# Altium schematic sheet Sheet4_Carregador_Bateria.SchDoc
size A4; SheetNumber: 4; SheetTotal: 6
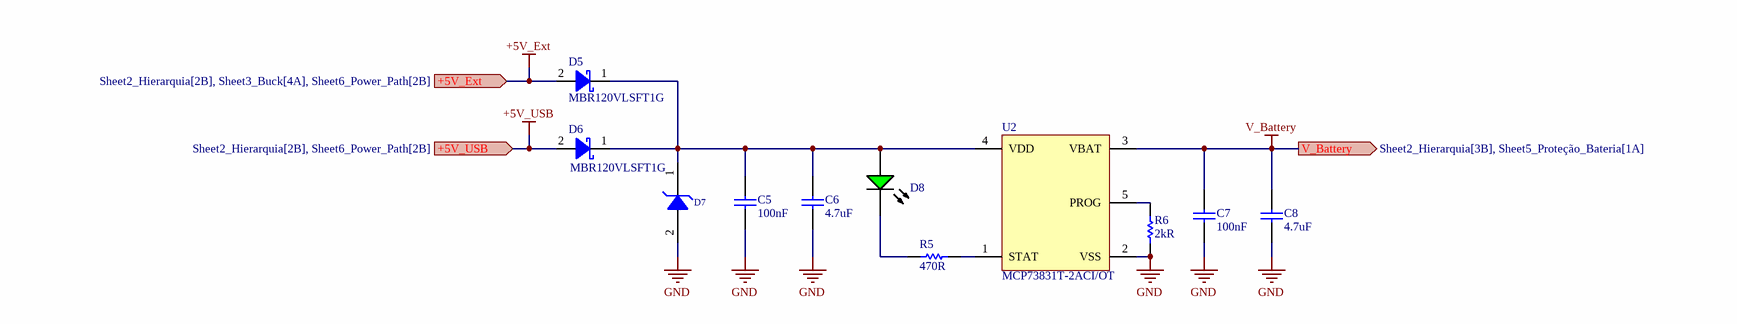
[diagram p0: Sheet4_Carregador_Bateria.SchDoc]

## Parts
?  (no value)  (graphical)
C5  value 100nF  [C-0805]  (hidden comment: CL21B104KACNNNC)
C6  value 4.7uF  [C-0805]  (hidden comment: C2012X5R1E475K125AB)
C7  value 100nF  [C-0805]  (hidden comment: CL21B104KACNNNC)
C8  value 4.7uF  [C-0805]  (hidden comment: C2012X5R1E475K125AB)
D5  MBR120VLSFT1G  [SOD-123F]
D6  MBR120VLSFT1G  [SOD-123F]
D7  SMAJ5.0A-13-F  [DO-214AC]  (value not drawn)
D8  LTST-C170GKT  [0805-LED-G]  (value not drawn)
R5  value 470R  [R-0805]  (hidden comment: CRGCQ0805J470R)
R6  value 2kR  [R-0805]  (hidden comment: ERJ-6ENF2001V)
U2  MCP73831T-2ACI/OT  [TSOT-23-5_A]

## Ports
+5V_Ext (in, see Sheet2_Hierarquia[2B], Sheet3_Buck[4A], Sheet6_Power_Path[2B]), +5V_USB (in, see Sheet2_Hierarquia[2B], Sheet6_Power_Path[2B]), V_Battery (out, see Sheet2_Hierarquia[3B], Sheet5_Proteção_Bateria[1A])

## Nets
+5V_Ext: D5.2(A) ; port +5V_Ext
+5V_USB: D6.2(A) ; port +5V_USB
GND: C5.2 C6.2 C7.2 C8.2 D7.2(A) R6.1 U2.2(VSS)
V_Battery: C7.1 C8.1 U2.3(VBAT) ; port V_Battery
NetC5_1: C5.1 C6.1 D5.1(K) D6.1(K) D7.1(K) D8.2(A) U2.4(VDD)
NetD8_1: D8.1(K) R5.1
NetR5_2: R5.2 U2.1(STAT)
NetR6_2: R6.2 U2.5(PROG)

## Notes on the sheet
- Título:
- Endereço
- Rua Aprígio Veloso, 1500 - Bodocongó
  CEP: 58.429-140
  Campina Grande - Paraíba
  Brasil
- Projeto:
- Conta:
- Projetista:
- Arquivo:
- Data:
- Revisor:
- Rev.:
- Pág.:
- de

## Library data of the parts
? = Title Block
C5 C7 = CL21B104KACNNNC: CAP CER 0.1UF 25V X7R 0805; Manufacturer: Samsung; Material: Ceramic; Tolerance: 10%; Supplier: Digikey; Supplier Part Number: 1276-1099-6-ND; Manufacturer Part Number: CL21B104KACNNNC; RoHS: Yes; Category: Ceramic Capacitors; Stock: 257719; Pricing: 1=0,1, 10=0,031, 50=0,0208, 100=0,0178, 500=0,01262, 1000=0,01102 (USD); Mounting Technology: Surface Mount; Case/Package: 0805; Case Code (Metric): 2012; Case Code (Imperial): 0805; Min Operating Temperature: -55°C; Max Operating Temperature: 125°C; Package Quantity: 1; Packaging: Tape and Reel; Voltage Rating: 25V; Dielectric: X7R; Voltage: 25V; Series: CL; Construction: Flat; Length: 2mm; Width: 0.049inch; Height: 0.85mm; Thickness: 0.037inch; Depth: 1.25mm; Radiation Hardening: No; RoHS Compliant: Yes; ComponentLink1URL: https://datasheet.ciiva.com/25801/cl21b104kacnnnc-25801824.pdf?src-supplier=Digikey; ComponentLink1Description: https://datasheet.ciiva.com/25801/cl21b104kacnnnc-25801824.pdf?src-supplier=Digikey; ComponentLink2URL: https://datasheet.ciiva.com/15216/getdatasheetpartid-355204-15216236.pdf?src-supplier=Verical; ComponentLink2Description: https://datasheet.ciiva.com/15216/getdatasheetpartid-355204-15216236.pdf?src-supplier=Verical; Supplier 1: Digikey; Supplier Part Number 1: 1276-1099-1-ND; Supplier 2: Mouser; Supplier Part Number 2: 187-CL21B104KACNNNC; Voltage Rating (DC): 25V
C6 C8 = C2012X5R1E475K125AB: CAP CER 4.7UF 25V X5R 0805; Manufacturer: TDK; Dielectric Material: Ceramic; Tolerance: 10%; Supplier: Digikey; Supplier Part Number: 445-4116-1-ND; Manufacturer Part Number: C2012X5R1E475K125AB; RoHS: Yes; Category: Ceramic Capacitors; Stock: 2075676; Pricing: 1=0,27, 10=0,158, 50=0,1126, 100=0,0984, 500=0,07452, 1000=0,06706 (USD); Mounting Technology: Surface Mount; Case/Package: 0805; Pins: 2; Case Code (Imperial): 0805; Case Code (Metric): 2012; Weight: 0.000194oz; Material: Ceramic; Min Operating Temperature: -55°C; Max Operating Temperature: 85°C; Voltage Rating: 25V; Voltage Rating (DC): 25V; Packaging: Tape and Reel; Package Quantity: 2000; Dielectric: X5R; Termination: SMD/SMT; Voltage: 25V; Series: C; Construction: Flat; Length: 2mm; Width: 1.25mm; Height: 1.25mm; Depth: 1.25mm; Reach SVHC Compliant: No; Lead Free: Lead Free; RoHS Compliant: Yes; ComponentLink1URL: https://datasheet.ciiva.com/24216/tdkmlcccaprange-24216480.pdf?src-supplier=Mouser; ComponentLink1Description: https://datasheet.ciiva.com/24216/tdkmlcccaprange-24216480.pdf?src-supplier=Mouser; ComponentLink2URL: https://datasheet.ciiva.com/11788/0900766b80c1bb00-11788107.pdf?src-supplier=Rs; ComponentLink2Description: https://datasheet.ciiva.com/11788/0900766b80c1bb00-11788107.pdf?src-supplier=Rs; ComponentLink3URL: https://datasheet.ciiva.com/6251/tdkmlcccaprange-6251817.pdf?src-supplier=Digikey; ComponentLink3Description: https://datasheet.ciiva.com/6251/tdkmlcccaprange-6251817.pdf?src-supplier=Digikey; ComponentLink4URL: https://datasheet.ciiva.com/6251/tdkmlcccaprange-6251820.pdf?src-supplier=Digikey; ComponentLink4Description: https://datasheet.ciiva.com/6251/tdkmlcccaprange-6251820.pdf?src-supplier=Digikey; ComponentLink5URL: https://datasheet.ciiva.com/6251/tdkmlcccaprange-6251823.pdf?src-supplier=Digikey; ComponentLink5Description: https://datasheet.ciiva.com/6251/tdkmlcccaprange-6251823.pdf?src-supplier=Digikey; ComponentLink6URL: https://datasheet.ciiva.com/28602/1744655-28602173.pdf?src-supplier=Element14; ComponentLink6Description: https://datasheet.ciiva.com/28602/1744655-28602173.pdf?src-supplier=Element14; ComponentLink7URL: https://datasheet.ciiva.com/36857/1796654-36857301.pdf?src-supplier=Element14; ComponentLink7Description: https://datasheet.ciiva.com/36857/1796654-36857301.pdf?src-supplier=Element14; ComponentLink8URL: https://datasheet.ciiva.com/16449/e412-c-16449599.pdf?src-supplier=Future+Electronics; ComponentLink8Description: https://datasheet.ciiva.com/16449/e412-c-16449599.pdf?src-supplier=Future+Electronics; Supplier 1: Mouser; Supplier Part Number 1: 810-C2012X5R1E475K; Supplier 2: Digikey; Supplier Part Number 2: 445-4116-1-ND
D5 D6 = MBR120VLSFT1G: DIODE SCHOTTKY 20V 1A SOD123FL; Manufacturer: ON Semiconductor; Max Surge Current: 45A; Forward Voltage: 340mV; Max Reverse Current: 600uA; Element Configuration: Single; Polarity: Standard; Supplier: Digikey; Supplier Part Number: MBR120VLSFT1GOSCT-ND; Manufacturer Part Number: MBR120VLSFT1G; RoHS: Yes; Category: Schottky Diodes; Stock: 20847; Pricing: 1=0,56, 10=0,348, 100=0,2217, 500=0,16708, 1000=0,14944 (USD); Pins: 2; Min Operating Temperature: -65°C; Max Operating Temperature: 125°C; Package Quantity: 3000; Forward Current: 1A; Packaging: Tape and Reel; Max Reverse Leakage Current: 600uA; Average Rectified Current: 1A; Max Repetitive Reverse Voltage (Vrrm): 20V; Max Forward Surge Current (Ifsm): 45A; Peak Non-Repetitive Surge Current: 45A; Voltage Rating (DC): 20V; Current Rating: 1A; Output Current: 1A; Max Reverse Voltage (DC): 20V; Series: -; Length: 0.114inch; Width: 0.071inch; Height: 0.035inch; Radiation Hardening: No; Reach SVHC Compliant: No; Lead Free: Lead Free; Halogen Free: Halogen Free; RoHS Compliant: Yes; ComponentLink1URL: https://datasheet.ciiva.com/7962/85900-7962720.pdf?src-supplier=Element14; ComponentLink1Description: https://datasheet.ciiva.com/7962/85900-7962720.pdf?src-supplier=Element14; ComponentLink2URL: https://datasheet.ciiva.com/915/mbr120vlsft1-d-915659.pdf?src-supplier=Digikey; ComponentLink2Description: https://datasheet.ciiva.com/915/mbr120vlsft1-d-915659.pdf?src-supplier=Digikey; ComponentLink3URL: https://datasheet.ciiva.com/915/mbr120vlsft1-d-915660.pdf?src-supplier=Digikey; ComponentLink3Description: https://datasheet.ciiva.com/915/mbr120vlsft1-d-915660.pdf?src-supplier=Digikey; ComponentLink4URL: https://datasheet.ciiva.com/18435/70100467-18435526.pdf?src-supplier=Allied+Electronics; ComponentLink4Description: https://datasheet.ciiva.com/18435/70100467-18435526.pdf?src-supplier=Allied+Electronics; ComponentLink5URL: https://datasheet.ciiva.com/16392/mbr120vlsft1-d-16392906.pdf?src-supplier=Future+Electronics; ComponentLink5Description: https://datasheet.ciiva.com/16392/mbr120vlsft1-d-16392906.pdf?src-supplier=Future+Electronics; Supplier 1: Digikey; Supplier Part Number 1: MBR120VLSFT1GOSCT-ND; Supplier 2: Mouser; Supplier Part Number 2: 863-MBR120VLSFT1G
D7 = SMAJ5.0A-13-F: TVS DIODE 5VWM 9.2VC SMA; Manufacturer: Diodes; Working Voltage: 5V; Clamping Voltage: 9.2V; Peak Pulse Power: 400W; Breakdown Voltage: 6.4V; Peak Pulse Current: 43.5A; Number of Elements: 1; Max Surge Current: 40A; Polarity: Unidirectional; Test Current: 10mA; Leakage Current: 800uA; Power Line Protection: No; Diode Type: ZENER; Max Breakdown Voltage: 7.25V; Element Configuration: Single; Capacitance: 2nF; Forward Voltage: 3.5V; Manufacturer Part Number: SMAJ5.0A-13-F; RoHS: Yes; Category: TVS Diodes; Stock 1: 435542; Pricing 1: 1=0,42000, 10=0,31700, 100=0,19770, 500=0,13528, 1000=0,10406, 2000=0,09366 (USD); Mount: Surface Mount; Case/Package: SMA; Number of Pins: 2; Contact Plating: Tin,Matte; Min Operating Temperature: -55°C; Max Operating Temperature: 150°C; Package Quantity: 5000; Termination: SMD/SMT; Series: -; Packaging: Tape and Reel; Reverse Standoff Voltage: 5V; Max Power Dissipation: 400W; Reverse Breakdown Voltage: 6.4V; Voltage Rating (DC): 5V; Min Breakdown Voltage: 6.4V; Resistor Type: Zener; Number of Unidirectional Channels: 1; Direction: Unidirectional; Max Reverse Leakage Current: 800uA; Power Dissipation: 400W; Clamping Voltage-Max: 9.2V; Max Output Current: 43.5A; ESD Protection: No; Length: 4.6mm; Width: 2.92mm; Height: 2.1mm; Radiation Hardening: No; RoHS Compliant: Yes; Lead Free: Lead Free; REACH SVHC: No SVHC; ComponentLink1URL: https://datasheet.ciiva.com/27052/1542127-27052431.pdf?src-supplier=Jameco; ComponentLink1Description: https://datasheet.ciiva.com/27052/1542127-27052431.pdf?src-supplier=Jameco; ComponentLink2URL: https://datasheet.ciiva.com/22696/1670961-22696859.pdf?src-supplier=Element14; ComponentLink2Description: https://datasheet.ciiva.com/22696/1670961-22696859.pdf?src-supplier=Element14; ComponentLink3URL: https://datasheet.ciiva.com/26933/getdatasheetpartid-35116-26933158.pdf?src-supplier=Verical; ComponentLink3Description: https://datasheet.ciiva.com/26933/getdatasheetpartid-35116-26933158.pdf?src-supplier=Verical; Supplier 1: Digi-Key; Supplier 2: Mouser; Supplier 3: Arrow Electronics; Supplier 4: Digi-Key; Supplier 5: Mouser; Supplier 6: Digi-Key; Supplier 7: Mouser; Supplier Part Number 7: 863-SZ1SMA5.0AT3G; Supplier Part Number 6: F11528CT-ND; Supplier Part Number 5: 625-SMAJ5.0A-E3; Supplier Part Number 4: SMAJ5.0A-E3/61GICT-ND; Supplier Part Number 3: SMAJ5.0A-13-F; Supplier Part Number 2: 621-SMAJ5.0A-13-F; Supplier Part Number 1: SMAJ5.0A-FDICT-ND; JLCPCB Part: C87074
D8 = LTST-C170GKT: LED GREEN CLEAR SMD; Manufacturer: Vishay Lite-On; Lens Color: Colorless; Luminous Intensity: 6mcd; Forward Voltage: 2.1V; Test Current: 10mA; Wavelength: 565nm; Viewing Angle: 130°; Dominant Wavelength: 569nm; Lens Style: Diffused,Colorless,Rectangular; Forward Current: 30mA; Number of LEDs: 1; Power Dissipation: 100mW; Reverse Voltage: 5V; Supplier 1: Digi-Key; Manufacturer Part Number: LTST-C170GKT; RoHS: Yes; Category: LEDs; Stock 1: 753504; Pricing 1: 1=0,30000, 10=0,16000, 100=0,07440, 500=0,06870, 1000=0,05382 (USD); Mount: Surface Mount; Case/Package: 0805; Number of Pins: 2; Color: Green; Case Code (Metric): 2012; Case Code (Imperial): 0805; Min Operating Temperature: -55°C; Max Operating Temperature: 85°C; Package Quantity: 1; Packaging: Tape and Reel; Series: CHIPLED 0805; Lens Transparency: Clear; Illumination Color: Green; Number of Elements: 1; Power Rating: 100mW; Voltage: 5V; Length: 2mm; Width: 1.25mm; Height: 1.1mm; Depth: 1.25mm; Radiation Hardening: No; RoHS Compliant: Yes; Lead Free: Lead Free; ComponentLink1URL: https://datasheet.ciiva.com/2110/ltst-c170gkt-2110128.pdf?src-supplier=Digi-Key; ComponentLink1Description: https://datasheet.ciiva.com/2110/ltst-c170gkt-2110128.pdf?src-supplier=Digi-Key; ComponentLink2URL: https://datasheet.ciiva.com/11773/0900766b80dc0278-11773630.pdf?src-supplier=RSComponents; ComponentLink2Description: https://datasheet.ciiva.com/11773/0900766b80dc0278-11773630.pdf?src-supplier=RSComponents; ComponentLink3URL: https://datasheet.ciiva.com/12400/lite-on-ltst-c170gkt-187191-12400783.pdf?src-supplier=Mouser; ComponentLink3Description: https://datasheet.ciiva.com/12400/lite-on-ltst-c170gkt-187191-12400783.pdf?src-supplier=Mouser; ComponentLink4URL: https://datasheet.ciiva.com/15117/getdatasheetpartid-142079-15117738.pdf?src-supplier=Verical; ComponentLink4Description: https://datasheet.ciiva.com/15117/getdatasheetpartid-142079-15117738.pdf?src-supplier=Verical; ComponentLink5URL: https://datasheet.ciiva.com/25772/ltst-c170gkt-25772881.pdf?src-supplier=Allied+Electronics; ComponentLink5Description: https://datasheet.ciiva.com/25772/ltst-c170gkt-25772881.pdf?src-supplier=Allied+Electronics; ComponentLink6URL: https://datasheet.ciiva.com/16387/ltst-c170gkt-16387357.pdf?src-supplier=Future+Electronics; ComponentLink6Description: https://datasheet.ciiva.com/16387/ltst-c170gkt-16387357.pdf?src-supplier=Future+Electronics; Supplier 2: Mouser; Supplier Part Number 2: 859-LTST-C170GKT; Supplier Part Number 1: 160-1179-1-ND; JLCPCB Part: C125090
R5 = CRGCQ0805J470R: RES 470 OHM 5% 1/8W 0805; Manufacturer: TE Connectivity; Max Power Dissipation: 125mW; Temperature Coefficient: 100ppm/°C; Operating Supply Voltage: 150V; Supplier: Digikey; Supplier Part Number: A130132CT-ND; Manufacturer Part Number: CRGCQ0805J470R; RoHS: Yes; Category: Chip SMD Resistors; Stock: 837845; Pricing: 1=0,1, 10=0,026, 50=0,0162, 100=0,0137, 500=0,00942, 1000=0,00813 (USD); Case/Package: 0805; Case Code (Imperial): 0805; Case Code (Metric): 2012; Min Operating Temperature: -55°C; Max Operating Temperature: 155°C; Features: Moisture Resistant,Automotive AEC-Q200; Series: CRGCQ; Packaging: Cut Tape; Tolerance: 5%; Number of Terminations: 2; Power Rating: 125mW; Voltage Rating: 150V; Voltage Rating (DC): 150V; Height: 650um; Ratings: AEC-Q200; RoHS Compliant: Yes; ComponentLink1URL: http://datasheet.octopart.com/CRGCQ0805J470R-TE-Connectivity-datasheet-114679081.pdf?src-supplier=Digikey; ComponentLink1Description: http://datasheet.octopart.com/CRGCQ0805J470R-TE-Connectivity-datasheet-114679081.pdf?src-supplier=Digikey; ComponentLink2URL: http://datasheet.octopart.com/CRGCQ0805J470R-TE-Connectivity-datasheet-114679081.pdf?src-supplier=Farnell; ComponentLink2Description: http://datasheet.octopart.com/CRGCQ0805J470R-TE-Connectivity-datasheet-114679081.pdf?src-supplier=Farnell; ComponentLink3URL: http://datasheet.octopart.com/CRGCQ0805J470R-TE-Connectivity-datasheet-114679081.pdf?src-supplier=Avnet; ComponentLink3Description: http://datasheet.octopart.com/CRGCQ0805J470R-TE-Connectivity-datasheet-114679081.pdf?src-supplier=Avnet; ComponentLink4URL: http://datasheet.octopart.com/CRGCQ0805J470R-TE-Connectivity-datasheet-114679081.pdf?src-supplier=Mouser; ComponentLink4Description: http://datasheet.octopart.com/CRGCQ0805J470R-TE-Connectivity-datasheet-114679081.pdf?src-supplier=Mouser; ComponentLink5URL: http://datasheet.octopart.com/CRGCQ0805J470R-TE-Connectivity-datasheet-114679081.pdf?src-supplier=Newark; ComponentLink5Description: http://datasheet.octopart.com/CRGCQ0805J470R-TE-Connectivity-datasheet-114679081.pdf?src-supplier=Newark; ComponentLink6URL: http://datasheet.octopart.com/CRGCQ0805J470R-TE-Connectivity-datasheet-114679081.pdf?src-supplier=Onlinecomponents.com; ComponentLink6Description: http://datasheet.octopart.com/CRGCQ0805J470R-TE-Connectivity-datasheet-114679081.pdf?src-supplier=Onlinecomponents.com; ComponentLink7URL: https://datasheet.octopart.com/CRGCQ0805J470R-TE-Connectivity-datasheet-114679081.pdf?src-supplier=Master+Electronics; ComponentLink7Description: https://datasheet.octopart.com/CRGCQ0805J470R-TE-Connectivity-datasheet-114679081.pdf?src-supplier=Master+Electronics; ComponentLink8URL: http://datasheet.octopart.com/CRGCQ0805J470R-TE-Connectivity-datasheet-114679081.pdf?src-supplier=Heilind+Electronics; ComponentLink8Description: http://datasheet.octopart.com/CRGCQ0805J470R-TE-Connectivity-datasheet-114679081.pdf?src-supplier=Heilind+Electronics; ComponentLink9URL: http://datasheet.octopart.com/CRGCQ0805J470R-TE-Connectivity-datasheet-114679081.pdf?src-supplier=Sager+Electronics; ComponentLink9Description: http://datasheet.octopart.com/CRGCQ0805J470R-TE-Connectivity-datasheet-114679081.pdf?src-supplier=Sager+Electronics; ComponentLink10URL: http://datasheet.octopart.com/CRGCQ0805J470R-TE-Connectivity-datasheet-114679081.pdf?src-supplier=Interstate+Connecting+Components; ComponentLink10Description: http://datasheet.octopart.com/CRGCQ0805J470R-TE-Connectivity-datasheet-114679081.pdf?src-supplier=Interstate+Connecting+Components; ComponentLink11URL: http://datasheet.octopart.com/CRGCQ0805J470R-TE-Connectivity-datasheet-114679081.pdf?src-supplier=Electro+Sonic; ComponentLink11Description: http://datasheet.octopart.com/CRGCQ0805J470R-TE-Connectivity-datasheet-114679081.pdf?src-supplier=Electro+Sonic; Supplier 1: Mouser; Supplier Part Number 1: 279-CRGCQ0805J470R; Supplier 2: Digikey; Supplier Part Number 2: A130132CT-ND
R6 = ERJ-6ENF2001V: RES SMD 2K OHM 1% 1/8W 0805; Manufacturer: Panasonic; Power Rating: 125mW; Voltage Rating: 150V; Temperature Coefficient: 100ppm/°C; Supplier: Digikey; Supplier Part Number: P2.00KCCT-ND; Manufacturer Part Number: ERJ-6ENF2001V; RoHS: Yes; Category: Chip SMD Resistors; Stock: 369929; Pricing: 1=0,11, 10=0,053, 50=0,0344, 100=0,0292, 500=0,02058, 1000=0,01792 (USD); Mounting Technology: Surface Mount; Case/Package: 0805; Case Code (Metric): 2012; Case Code (Imperial): 0805; Contact Plating: Tin; Weight: 0.000194oz; Min Operating Temperature: -55°C; Max Operating Temperature: 155°C; Packaging: Tape and Reel; Tolerance: 1%; Package Quantity: 1; Resistor Type: Thick Film; Number of Terminations: 2; Termination: SMD/SMT; Max Power Dissipation: 125mW; Voltage Rating (DC): 150V; Features: Automotive AEC-Q200; Series: ERJ; Resistance Tolerance: 1%; Construction: Rectangular; Technology: THICK FILM; Length: 2mm; Width: 1.2mm; Height: 0.6mm; Depth: 1.25mm; Radiation Hardening: No; Reach SVHC Compliant: No; Military Standard: Not; Lead Free: Lead Free; RoHS Compliant: Yes; Supplier 1: Mouser; Supplier Part Number 1: 667-ERJ-6ENF2001V; Supplier 2: Digikey; Supplier Part Number 2: P2.00KCCT-ND; Supplier 3: Digikey; Supplier Part Number 3: P2.00KCCT-ND
U2 = MCP73831T-2ACI/OT: IC BATT CNTL LI-ION 1CEL SOT23-5; Manufacturer: Microchip; Number of Cells: 1; Max Supply Voltage: 6V; Output Voltage: 4.2V; Min Supply Voltage: 3.75V; Output Current: 500mA; Max Output Voltage: 4.5V; Max Power Dissipation: 1.54W; Drain to Source Resistance: 350mR; Min Output Voltage: 4.168V; Voltage Rating: 4.534V; Fault Protection: Over Voltage; Supplier: Digikey; Supplier Part Number: MCP73831T-2ACI/OTCT-ND; Manufacturer Part Number: MCP73831T-2ACI/OT; RoHS: Yes; Category: Battery Management; Stock: 95605; Pricing: 1=0,76, 25=0,63, 100=0,6125 (USD); Mounting Technology: Surface Mount; Case/Package: SOT-23; Pins: 5; Weight: 0.00709oz; Min Operating Temperature: -40°C; Max Operating Temperature: 85°C; Number of Outputs: 1; Packaging: Tape and Reel; Number of Channels: 1; Termination: SMD/SMT; Max Charge Current: 500mA; Series: -; Battery Pack Voltage: 4.2V; Length: 3.1mm; Width: 1.8mm; Height: 1.3mm; Radiation Hardening: No; RoHS Compliant: Yes; Reach SVHC Compliant: No; Lead Free: Lead Free; ComponentLink1URL: https://datasheet.ciiva.com/22828/0900766b80d2b53a-22828876.pdf?src-supplier=Rs; ComponentLink1Description: https://datasheet.ciiva.com/22828/0900766b80d2b53a-22828876.pdf?src-supplier=Rs; ComponentLink2URL: https://datasheet.ciiva.com/26344/651521-da-01-en-contr-mcp73831t-2aci-ot-sot-23-5-mcp-26344458.pdf?src-supplier=Conrad; ComponentLink2Description: https://datasheet.ciiva.com/26344/651521-da-01-en-contr-mcp73831t-2aci-ot-sot-23-5-mcp-26344458.pdf?src-supplier=Conrad; ComponentLink3URL: https://datasheet.ciiva.com/1931/21984e-1931953.pdf?src-supplier=Digikey; ComponentLink3Description: https://datasheet.ciiva.com/1931/21984e-1931953.pdf?src-supplier=Digikey; ComponentLink4URL: https://datasheet.ciiva.com/1931/21984e-1931954.pdf?src-supplier=Digikey; ComponentLink4Description: https://datasheet.ciiva.com/1931/21984e-1931954.pdf?src-supplier=Digikey; ComponentLink5URL: https://datasheet.ciiva.com/1931/21984e-1931955.pdf?src-supplier=Digikey; ComponentLink5Description: https://datasheet.ciiva.com/1931/21984e-1931955.pdf?src-supplier=Digikey; ComponentLink6URL: https://datasheet.ciiva.com/3213/21984e-3213404.pdf?src-supplier=Avnet; ComponentLink6Description: https://datasheet.ciiva.com/3213/21984e-3213404.pdf?src-supplier=Avnet; ComponentLink7URL: https://datasheet.ciiva.com/28626/630369-28626439.pdf?src-supplier=Element14; ComponentLink7Description: https://datasheet.ciiva.com/28626/630369-28626439.pdf?src-supplier=Element14; ComponentLink8URL: https://datasheet.ciiva.com/46385/630369-46385324.pdf?src-supplier=Element14; ComponentLink8Description: https://datasheet.ciiva.com/46385/630369-46385324.pdf?src-supplier=Element14; ComponentLink9URL: https://datasheet.ciiva.com/1137/630369-1137803.pdf?src-supplier=Element14; ComponentLink9Description: https://datasheet.ciiva.com/1137/630369-1137803.pdf?src-supplier=Element14; ComponentLink10URL: https://datasheet.ciiva.com/1144/630369-1144461.pdf?src-supplier=Newark; ComponentLink10Description: https://datasheet.ciiva.com/1144/630369-1144461.pdf?src-supplier=Newark; ComponentLink11URL: https://datasheet.ciiva.com/16286/filehandler-aspxddocname-en025112-16286957.pdf?src-supplier=Future+Electronics; ComponentLink11Description: https://datasheet.ciiva.com/16286/filehandler-aspxddocname-en025112-16286957.pdf?src-supplier=Future+Electronics; Supplier 1: Digikey; Supplier Part Number 1: MCP73831T-2ACI/OTCT-ND; Supplier 2: Mouser; Supplier Part Number 2: 579-MCP73831T-2ACIOT